# EAGLE design frontpanel (EAGLE 9.6.2)
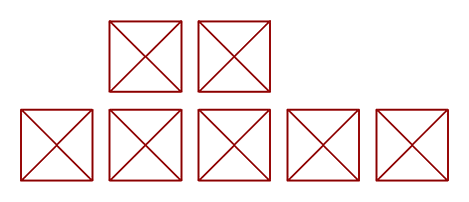
[diagram p0: schematic, sheet 1]

## Parts
U$1  HOLESDCBARREL2.1  [DCBARREL2.1]
U$2  HOLESLED_THROUGH_PCB  [ADAFRUIT_CHIPLED_0603_REVERSE_NOLED]
U$3  HOLESRJ45_NOSHIELD  [RJ45HOLE_NOSHIELD]
U$4  HOLESRJ45_NOSHIELD  [RJ45HOLE_NOSHIELD]
U$5  HOLESRJ45_NOSHIELD  [RJ45HOLE_NOSHIELD]
U$6  HOLESRJ45  [RJ45HOLE]
U$8  HOLESLED_THROUGH_PCB  [ADAFRUIT_CHIPLED_0603_REVERSE_NOLED]

## Library data of the parts
U$1-U$6 U$8 = Multischriever:HOLES

## Board
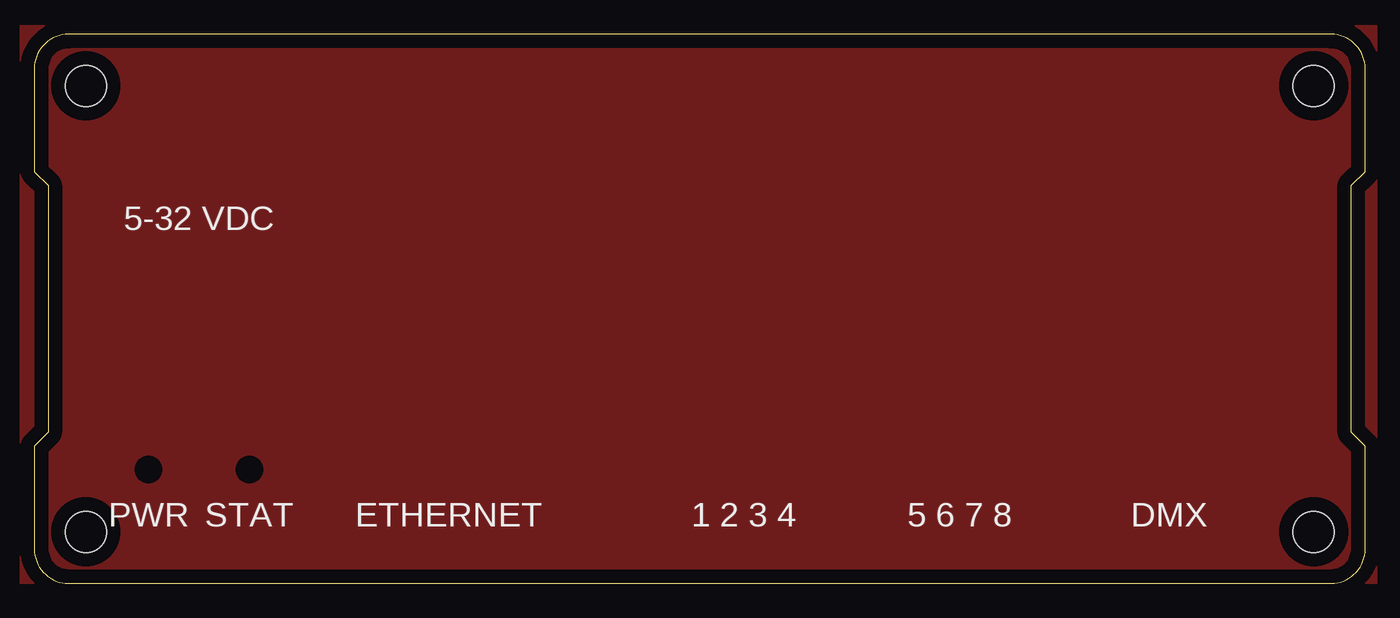
[diagram p1: board, top side]

Size 97 x 40 mm. Coordinates in mm from the lower left corner, seen from the top.
Outline: 0,37.5 0,30 1,29 1,11 0,10 0,2.5 arc90 2.5,0 94.5,0 arc90 97,2.5 97,10 96,11 96,29 97,30 97,37.5 arc90 94.5,40 2.5,40 arc90 0,37.5
Copper layers (1*16): Top 0.035mm / dielectric 1.5mm / Bottom 0.035mm
Design rules "default *": minimum track width 6mil, minimum drill 0.35mm, track to track 8mil, track to pad 8mil, pad to pad 8mil, via to via 8mil, smd to smd 6mil, copper to edge 40mil, drill to drill 6mil, minimum pad ring 10mil, minimum via ring 8mil, stop-mask expansion 4mil, vias tented up to drill 0mil, thermal gap 10mil
Holes 3 mm at 3.75,36.25 93.25,36.25 93.25,3.75 3.75,3.75
bKeepout: area 0,0 to 5,40; area 92,0 to 97,40; area 0,0 to 97,7.6; area 0,38 to 97,40; area 0,34 to 6,40; area 0,0 to 6,6; area 91,0 to 97,6; area 91,34 to 97,40

### Placement (x,y rotation side)
U$1  12,18.5 90 top
U$2  8.33,8.3 0 top
U$3  82.7,7.6 0 top
U$4  67.44,7.6 0 top
U$5  51.7,7.6 0 top
U$6  30.57,9.25 0 top
U$7  [MULTISCHRIEVERLOGO_SOLDERMASK]  12,32.4 0 top
U$8  15.67,8.3 0 top

### Tracks (layer width: path | path; a pad name or v marks a point on that pad's centre or on a via)
N$1
  pour Top: -1,40.64 97.79,40.64 97.79,0 -1,0

### Text on the board
_tsilk: 5-32 VDC | PWR | STAT | ETHERNET | 1 2 3 4 | 5 6 7 8 | DMX
_bsilk: JLCJLCJLCJLC | HyperNode Front REVA